# EAGLE schematic snarc+ (EAGLE 6.2)
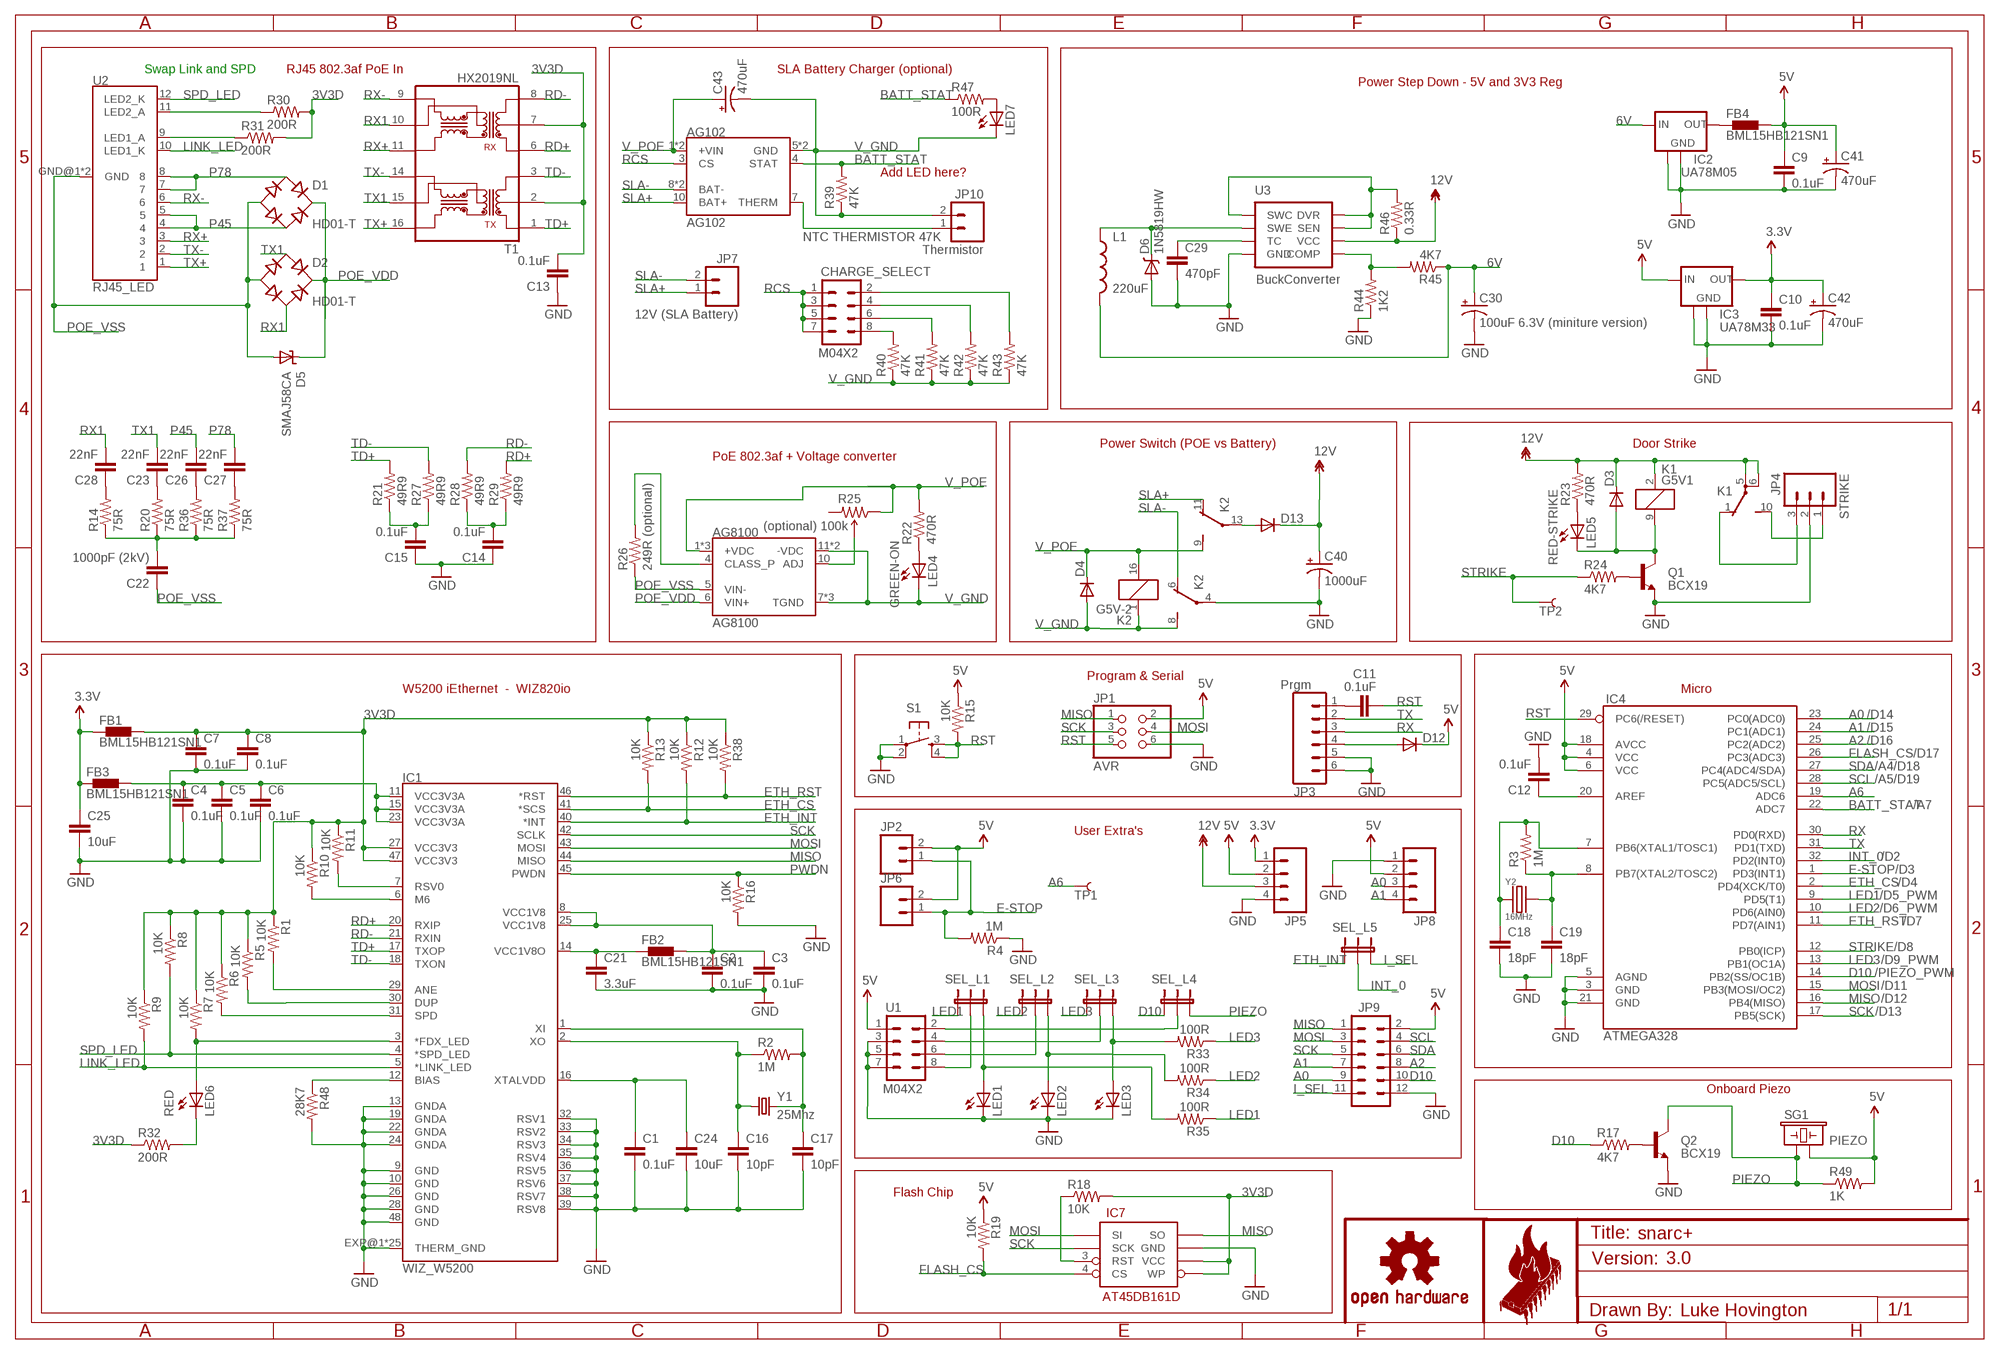
[diagram p0: schematic, sheet 1]

## Parts
AG102  AG102  [AG102]
AG8100  AG8100  [AG8100]
C1  0.1uF  CAP0402-CAP  [0402-CAP]
C2  0.1uF  CAP0402-CAP  [0402-CAP]
C3  0.1uF  CAP0402-CAP  [0402-CAP]
C4  0.1uF  CAP0402-CAP  [0402-CAP]
C5  0.1uF  CAP0402-CAP  [0402-CAP]
C6  0.1uF  CAP0402-CAP  [0402-CAP]
C7  0.1uF  CAP0402-CAP  [0402-CAP]
C8  0.1uF  CAP0402-CAP  [0402-CAP]
C9  0.1uF  CAP0402-CAP  [0402-CAP]
C10  0.1uF  CAP0402-CAP  [0402-CAP]
C11  0.1uF  CAP0402-CAP  [0402-CAP]
C12  0.1uF  CAP0402-CAP  [0402-CAP]
C13  0.1uF  CAP0402-CAP  [0402-CAP]
C14  0.1uF  CAP0402-CAP  [0402-CAP]
C15  0.1uF  CAP0402-CAP  [0402-CAP]
C16  10pF  CAP0402-CAP  [0402-CAP]
C17  10pF  CAP0402-CAP  [0402-CAP]
C18  18pF  CAP0402-CAP  [0402-CAP]
C19  18pF  CAP0402-CAP  [0402-CAP]
C21  3.3uF  CAP0402-CAP  [0402-CAP]
C22  1000pF (2kV)  CAP0402-CAP  [0402-CAP]
C23  22nF  CAP0402-CAP  [0402-CAP]
C24  10uF  CAP0603-CAP  [0603-CAP]
C25  10uF  CAP0603-CAP  [0603-CAP]
C26  22nF  CAP0402-CAP  [0402-CAP]
C27  22nF  CAP0402-CAP  [0402-CAP]
C28  22nF  CAP0402-CAP  [0402-CAP]
C29  470pF  CAP0402-CAP  [0402-CAP]
C30  100uF 6.3V (miniture version)  CAP_POLC  [PANASONIC_C]
C40  1000uF  CAP_POLH13  [PANASONIC_H13]
C41  470uF  CAP_POLE  [PANASONIC_E]
C42  470uF  CAP_POLE  [PANASONIC_E]
C43  470uF  CAP_POLE  [PANASONIC_E]
CHARGE_SELECT  M04X2  [2X4]
D1  HD01-T  B1S  [MBS]
D2  HD01-T  B1S  [MBS]
D3  DIODESOD  [SOD-323]
D4  DIODESOD  [SOD-323]
D5  SMAJ58CA  SUPPRESSOR-SMBJ  [SMBJ]
D6  1N5819HW  DIODE-SCHOTTKYSOD-123  [SOD-123]
D12  DIODESOD  [SOD-323]
D13  DIODESOD  [SOD-323]
FB1  BML15HB121SN1  [0402]
FB2  BML15HB121SN1  [0402]
FB3  BML15HB121SN1  [0402]
FB4  BML15HB121SN1  [0402]
IC1  WIZ_W5200  [QFN48]
IC2  UA78M05  V_REG_SOTXXX  [SOT223]
IC3  UA78M33  V_REG_SOTXXX  [SOT223]
IC4  ATMEGA328  ATMEGA168  [TQFP32-08]
IC7  AT45DB161D  [SO08-EIAJ]
JP1  AVR  PINHD-2X3  [2X03]
JP2  M023.5MM  [SCREWTERMINAL-3.5MM-2]
JP3  Prgm  M06SMD-STRAIGHT  [1X06_SMD_STRAIGHT]
JP4  STRIKE  M03SCREW  [SCREWTERMINAL-3.5MM-3]
JP5  M04SMD  [1X04-SMD]
JP6  M021X02_NO_SILK  [1X02_NO_SILK]
JP7  12V (SLA Battery)  M023.5MM  [SCREWTERMINAL-3.5MM-2]
JP8  M04POLAR  [MOLEX-1X4]
JP9  M05x2_SMD  M06X2  [2X6-SHROUDED_SMD]
JP10  Thermistor  M023.5MM  [SCREWTERMINAL-3.5MM-2]
K1  G5V1  [G5V1]
K2  G5V-2  [G5V-2]
L1  220uF  INDUCTOR  [SRN]
LED1  LED0603  [LED-0603]
LED2  LED0603  [LED-0603]
LED3  LED0603  [LED-0603]
LED4  GREEN-ON  LED0603  [LED-0603]
LED5  RED-STRIKE  LED0603  [LED-0603]
LED6  RED  LED0603  [LED-0603]
LED7  LED0603  [LED-0603]
Q1  BCX19  TRANSISTOR_NPNSOT23-3  [SOT23-3]
Q2  BCX19  TRANSISTOR_NPNSOT23-3  [SOT23-3]
R1  10K  RESISTOR0402-RES  [0402-RES]
R2  1M  RESISTOR0402-RES  [0402-RES]
R3  1M  RESISTOR0402-RES  [0402-RES]
R4  1M  RESISTOR0603-RES  [0603-RES]
R5  10K  RESISTOR0402-RES  [0402-RES]
R6  10K  RESISTOR0402-RES  [0402-RES]
R7  10K  RESISTOR0402-RES  [0402-RES]
R8  10K  RESISTOR0402-RES  [0402-RES]
R9  10K  RESISTOR0402-RES  [0402-RES]
R10  10K  RESISTOR0402-RES  [0402-RES]
R11  10K  RESISTOR0402-RES  [0402-RES]
R12  10K  RESISTOR0402-RES  [0402-RES]
R13  10K  RESISTOR0402-RES  [0402-RES]
R14  75R  RESISTOR0402-RES  [0402-RES]
R15  10K  RESISTOR0402-RES  [0402-RES]
R16  10K  RESISTOR0402-RES  [0402-RES]
R17  4K7  RESISTOR0402-RES  [0402-RES]
R18  10K  RESISTOR0402-RES  [0402-RES]
R19  10K  RESISTOR0402-RES  [0402-RES]
R20  75R  RESISTOR0402-RES  [0402-RES]
R21  49R9  RESISTOR0402-RES  [0402-RES]
R22  470R  RESISTOR0402-RES  [0402-RES]
R23  470R  RESISTOR0402-RES  [0402-RES]
R24  4K7  RESISTOR0402-RES  [0402-RES]
R25  (optional) 100k  TRIMPOTSMD  [TRIMPOT-3MM]
R26  249R (optional)  RESISTOR1206  [1206]
R27  49R9  RESISTOR0402-RES  [0402-RES]
R28  49R9  RESISTOR0402-RES  [0402-RES]
R29  49R9  RESISTOR0402-RES  [0402-RES]
R30  200R  RESISTOR0402-RES  [0402-RES]
R31  200R  RESISTOR0402-RES  [0402-RES]
R32  200R  RESISTOR0402-RES  [0402-RES]
R33  100R  RESISTOR0402-RES  [0402-RES]
R34  100R  RESISTOR0402-RES  [0402-RES]
R35  100R  RESISTOR0402-RES  [0402-RES]
R36  75R  RESISTOR0402-RES  [0402-RES]
R37  75R  RESISTOR0402-RES  [0402-RES]
R38  10K  RESISTOR0402-RES  [0402-RES]
R39  47K  RESISTOR0402-RES  [0402-RES]
R40  47K  RESISTOR0402-RES  [0402-RES]
R41  47K  RESISTOR0402-RES  [0402-RES]
R42  47K  RESISTOR0402-RES  [0402-RES]
R43  47K  RESISTOR0402-RES  [0402-RES]
R44  1K2  RESISTOR0402-RES  [0402-RES]
R45  4K7  RESISTOR0402-RES  [0402-RES]
R46  0.33R  RESISTOR0402-RES  [0402-RES]
R47  100R  RESISTOR0402-RES  [0402-RES]
R48  28K7  RESISTOR0402-RES  [0402-RES]
R49  1K  RESISTOR0402-RES  [0402-RES]
S1  TAC_SWITCHSMD  [TACTILE_SWITCH_SMD]
SEL_L1  JUMPER-32-3  [SJ_3_PASTE2&3]
SEL_L2  JUMPER-32-3  [SJ_3_PASTE2&3]
SEL_L3  JUMPER-32-3  [SJ_3_PASTE2&3]
SEL_L4  JUMPER-32-3  [SJ_3_PASTE2&3]
SEL_L5  JUMPER-32-3  [SJ_3_PASTE2&3]
SG1  PIEZO  BUZZER  [PB158-BUZZER]
T1  HX2019NL  HX1188  [HXXXX]
TP1  TEST-POINT3X5  [PAD.03X.05]
TP2  TEST-POINT3X5  [PAD.03X.05]
U1  M04X2  [2X4]
U2  RJ45_LED  [RJHSE-5484]
U3  BuckConverter  MC34063SMD  [SO08]
U$15  OSHW-LOGOL  [OSHW-LOGO-L]
U$16  HSBNE_LOGOMED  [HSBNE_MED]
Y1  25Mhz  CRYSTALABM10  [CRYSTAL-SMD-2.5X2-ABM10]
Y2  16MHz  ABM8  [XTAL-CSX750]

## Nets
3.3V: C10.1 C25.1 C42.+ FB1.1 FB3.1 IC3.3(OUT) JP5.1
3V3A: C4.1 C5.1 C6.1 FB3.2 IC1.11(VCC3V3A) IC1.15(VCC3V3A) IC1.23(VCC3V3A)
3V3D: C7.1 C8.1 C13.2 FB1.2 IC1.27(VCC3V3) IC1.47(VCC3V3) IC7.5(WP) IC7.6(VCC) R1.1 R5.1 R6.1 R7.1 R8.1 R9.1 R10.1 R11.1 R12.1 R13.1 R18.2 R30.2 R31.2 R32.1 R38.1 T1.2 T1.7
5V: C9.1 C41.+ D12.1(C) FB4.2 IC3.1(IN) IC4.4(VCC) IC4.6(VCC) IC4.18(AVCC) JP1.2 JP2.2 JP5.2 JP6.2 JP8.2 JP9.2 R15.1 R19.1 R49.2 SG1.P$2 U1.1
6V: C30.+ IC2.1(IN) L1.P$2 R45.1
12V: C40.+ D3.1(C) D13.1(C) JP5.3 K1.2 K1.5(2:P) K1.6(2:P) R23.2 R46.1 U3.6(VCC)
A0: IC4.23(PC0(ADC0)) JP8.3 JP9.9
A1: IC4.24(PC1(ADC1)) JP8.4 JP9.7
A2: IC4.25(PC2(ADC2)) JP9.8
A6: IC4.19(ADC6) TP1.P$1
AREF1: C12.1 IC4.20(AREF)
BATT_STAT: AG102.4(STAT) IC4.22(ADC7) R39.2 R47.1
BATT_THERM: AG102.7(THERM) JP10.1
D10: IC4.14(PB2(SS/OC1B)) JP9.10 R17.1 SEL_L4.1
E-STOP: IC4.1(PD3(INT1)) JP2.1 JP6.1 R4.2
ETH_CS: IC1.41(*SCS) IC4.2(PD4(XCK/T0)) R13.2
ETH_INT: IC1.40(*INT) R12.2 SEL_L5.1
ETH_RST: IC1.46(*RST) IC4.11(PD7(AIN1)) R38.2
FDX_LED: IC1.3(*FDX_LED) LED6.A R7.2
FLASH_CS: IC4.26(PC3(ADC3)) IC7.4(CS) R19.2
GND: C1.2 C2.2 C3.2 C4.2 C5.2 C6.2 C7.2 C8.2 C9.2 C10.2 C12.2 C13.1 C14.1 C15.1 C16.2 C17.2 C18.2 C19.2 C21.2 C24.2 C25.2 C29.2 C30.- C40.- C41.- C42.- D6.2(A) IC1.9(GND) IC1.10(GND) IC1.13(GNDA) IC1.19(GNDA) IC1.22(GNDA) IC1.24(GNDA) IC1.26(GND) IC1.28(GND) IC1.32(RSV1) IC1.33(RSV2) IC1.34(RSV3) IC1.35(RSV4) IC1.36(RSV5) IC1.37(RSV6) IC1.38(RSV7) IC1.39(RSV8) IC1.48(GND) IC1.EXP@1(THERM_GND) IC1.EXP@2(THERM_GND) IC1.EXP@3(THERM_GND) IC1.EXP@4(THERM_GND) IC1.EXP@5(THERM_GND) IC1.EXP@6(THERM_GND) IC1.EXP@7(THERM_GND) IC1.EXP@8(THERM_GND) IC1.EXP@9(THERM_GND) IC1.EXP@10(THERM_GND) IC1.EXP@11(THERM_GND) IC1.EXP@12(THERM_GND) IC1.EXP@13(THERM_GND) IC1.EXP@14(THERM_GND) IC1.EXP@15(THERM_GND) IC1.EXP@16(THERM_GND) IC1.EXP@17(THERM_GND) IC1.EXP@18(THERM_GND) IC1.EXP@19(THERM_GND) IC1.EXP@20(THERM_GND) IC1.EXP@21(THERM_GND) IC1.EXP@22(THERM_GND) IC1.EXP@23(THERM_GND) IC1.EXP@24(THERM_GND) IC1.EXP@25(THERM_GND) IC2.2(GND) IC2.4(GND1) IC3.2(GND) IC3.4(GND1) IC4.3(GND) IC4.5(AGND) IC4.21(GND) IC7.7(GND) JP1.6 JP3.5 JP3.6 JP4.2 JP5.4 JP8.1 JP9.12 K2.4(1:P) LED1.C LED2.C LED3.C Q1.2(E) Q2.2(E) R4.1 R16.2 R44.1 R48.2 S1.1 S1.2 U1.3 U1.5 U1.7 U3.4(GND)
I_SEL: JP9.11 SEL_L5.3
INT_0: IC4.32(PD2(INT0)) SEL_L5.2
LED1: IC4.9(PD5(T1)) R35.1 SEL_L1.1
LED2: IC4.10(PD6(AIN0)) R34.1 SEL_L2.1
LED3: IC4.13(PB1(OC1A)) R33.1 SEL_L3.1
LINK_LED: IC1.5(*LINK_LED) R9.2 U2.10(LED1_K)
MISO: IC1.44(MISO) IC4.16(PB4(MISO)) IC7.8(SO) JP1.1 JP9.1
MOSI: IC1.43(MOSI) IC4.15(PB3(MOSI/OC2)) IC7.1(SI) JP1.4 JP9.3
N$1: IC1.12(BIAS) R48.1
N$2: C1.1 C24.1 IC1.16(XTALVDD)
N$3: IC1.6(M6) R10.2
N$4: C2.1 C3.1 FB2.2 IC1.8(VCC1V8) IC1.25(VCC1V8)
N$5: C16.1 IC1.2(XO) R2.1 Y1.P$1
N$6: C17.1 IC1.1(XI) R2.2 Y1.P$3
N$7: IC1.29(ANE) R1.2
N$8: IC1.30(DUP) R5.2
N$9: C21.1 FB2.1 IC1.14(VCC1V8O)
N$10: IC1.31(SPD) R6.2
N$11: SEL_L3.2 U1.4
N$12: IC1.7(RSV0) R11.2
N$13: LED6.C R32.2
N$14: LED7.A R47.2
N$15: C28.1 R14.2
N$16: LED1.A R35.2 SEL_L1.3
N$17: AG8100.4(CLASS_P) R26.2
N$18: Q2.1(B) R17.2
N$20: C23.1 R20.2
N$21: C22.2 R14.1 R20.1 R36.1 R37.1
N$22: IC7.3(RST) R18.1
N$23: AG8100.10(ADJ) R25.2(WIPER)
N$24: FB4.1 IC2.3(OUT)
N$25: R30.1 U2.11(LED2_A)
N$26: D13.2(A) K2.13(2:P)
N$27: R31.1 U2.9(LED1_A)
N$28: C15.2 R21.1 R27.1
N$29: C18.1 IC4.7(PB6(XTAL1/TOSC1)) R3.2 Y2.1
N$30: C19.1 IC4.8(PB7(XTAL2/TOSC2)) R3.1 Y2.3
N$31: C14.2 R28.1 R29.1
N$32: C26.1 R36.2
N$33: CHARGE_SELECT.8 R40.2
N$34: CHARGE_SELECT.6 R41.2
N$35: CHARGE_SELECT.4 R42.2
N$36: CHARGE_SELECT.2 R43.2
N$37: R44.2 R45.2 U3.5(COMP)
N$38: C27.1 R37.2
N$39: SEL_L1.2 U1.8
N$40: C11.2 JP3.1
N$41: R46.2 U3.1(SWC) U3.7(SEN) U3.8(DVR)
N$42: LED2.A R34.2 SEL_L2.3
N$43: D6.1(C) L1.P$1 U3.2(SWE)
N$44: C29.1 U3.3(TC)
N$45: LED3.A R33.2 SEL_L3.3
N$65: D12.2(A) JP3.4
N$68: D3.2(A) K1.9 LED5.C Q1.3(C)
N$69: Q1.1(B) R24.2
N$70: LED5.A R23.1
N$71: LED4.A R22.1
N$74: SEL_L2.2 U1.6
N$100: SEL_L4.2 U1.2
P45: C26.2 D1.AC2 U2.4 U2.5
P78: C27.2 D1.AC1 U2.7 U2.8
PIEZO: Q2.3(C) R49.1 SEL_L4.3 SG1.P$1
POE_VDD: AG8100.6(VIN+) D1.+ D2.+ D5.C
POE_VSS: AG8100.5(VIN-) C22.1 D1.- D2.- D5.A R26.1 U2.GND@1(GND) U2.GND@2(GND)
PWDN: IC1.45(PWDN) R16.1
RCS: AG102.3(CS) CHARGE_SELECT.1 CHARGE_SELECT.3 CHARGE_SELECT.5 CHARGE_SELECT.7
RD+: IC1.20(RXIP) R29.2 T1.6
RD-: IC1.21(RXIN) R28.2 T1.8
RST: C11.1 IC4.29(PC6(/RESET)) JP1.5 R15.2 S1.3 S1.4
RX: IC4.30(PD0(RXD)) JP3.3
RX1: C28.2 D2.AC2 T1.10
RX+: T1.11 U2.3
RX-: T1.9 U2.6
SCK: IC1.42(SCLK) IC4.17(PB5(SCK)) IC7.2(SCK) JP1.3 JP9.5
SCL: IC4.28(PC5(ADC5/SCL)) JP9.4
SDA: IC4.27(PC4(ADC4/SDA)) JP9.6
SLA+: AG102.10(BAT+) JP7.1 K2.11(2:O)
SLA-: AG102.8(BAT-) AG102.9(BAT-) JP7.2 K2.6(1:O)
SPD_LED: IC1.4(*SPD_LED) R8.2 U2.12(LED2_K)
STRIKE: IC4.12(PB0(ICP)) R24.1 TP2.P$1
STRIKE_NC: JP4.3 K1.1(2:O)
STRIKE_NO: JP4.1 K1.10(2:S)
TD+: IC1.17(TXOP) R21.2 T1.1
TD-: IC1.18(TXON) R27.2 T1.3
TX: IC4.31(PD1(TXD)) JP3.2
TX1: C23.2 D2.AC1 T1.15
TX+: T1.16 U2.1
TX-: T1.14 U2.2
V_GND: AG102.5(GND) AG102.6(GND) AG8100.7(TGND) AG8100.8(TGND) AG8100.9(TGND) AG8100.11(-VDC) AG8100.12(-VDC) C43.- D4.2(A) JP10.2 K2.1 K2.8(1:S) LED4.C LED7.C R39.1 R40.1 R41.1 R42.1 R43.1
V_POE: AG102.1(+VIN) AG102.2(+VIN) AG8100.1(+VDC) AG8100.2(+VDC) AG8100.3(+VDC) C43.+ D4.1(C) K2.9(2:S) K2.16 R22.2 R25.1(CCW)
Unconnected: R25.3(CW)

## Notes on the sheet
- Swap Link and SPD | RJ45 802.3af PoE In | SLA Battery Charger (optional)
- Power Step Down - 5V and 3V3 Reg
- Add LED here?
- NTC THERMISTOR 47K
- Power Switch (POE vs Battery) | Door Strike
- PoE 802.3af + Voltage converter
- Program & Serial
- W5200 iEthernet  -  WIZ820io | Micro
- /D14
- /D15
- /D16
- /D17
- /A4/D18
- /A5/D19
- /A7
- User Extra's
- /D2
- /D3
- /D4
- /D5_PWM
- /D6_PWM
- /D7
- /D8
- /D9_PWM
- /PIEZO_PWM
- /D11
- /D12
- /D13
- Onboard Piezo
- Flash Chip
- 3.0
- Luke Hovington

## Library data of the parts
AG102 = pulse-luke:AG102
AG8100 = pulse-luke:AG8100
C1-C19 C21-C29 = SparkFun:CAP: Capacitor Standard 0603 ceramic capacitor, and 0.1" leaded capacitor.
C30 C40-C43 = SparkFun:CAP_POL: Capacitor Polarized These are standard SMD and PTH capacitors. Normally 10uF, 47uF, and 100uF in electrolytic and tantalum varieties. Always verify the external diameter of the through hole cap, it varies with capacity, voltage, and manufacturer. The EIA devices should be standard.
CHARGE_SELECT U1 = SparkFun:M04X2
D1 D2 = rectifier:B*S: Surface Mount Glass Passivated Bridge Rectifiers Source: Comchip Bridge Rectifiers B05S-G_B10S-G.pdf
D3 D4 D12 D13 = SparkFun:DIODE: Diode These are standard reverse protection diodes and small signal diodes. SMA package can handle up to about 1A. SOD-323 can handle about 200mA. What the SOD-323 package when ordering, there are some mfgs out there that are 5-pin packages.
D5 = diode:SUPPRESSOR-: Suppressor diode
D6 = SparkFun:DIODE-SCHOTTKY
FB1-FB4 = inductors:BML15H: EMIFIL (R) Chip Ferrite Bead for GHz Noise Source: http://www.murata.com/ Ferrite Bead BLM15H.pdf
IC1 = pulse-luke:WIZ_W5200
IC2 IC3 = rfbee:V_REG_SOTXXX
IC4 = SparkFun:ATMEGA168
IC7 = SparkFun-DigitalIC:AT45DB161D: 16-Mbit SPI flash memory
JP1 = pinhead:PINHD-2X3: PIN HEADER
JP2 JP6 JP7 JP10 = SparkFun:M02: Header 2 Standard 2-pin 0.1" header. Use with straight break away headers (SKU : PRT-00116), right angle break away headers (PRT-00553), swiss pins (PRT-00743), machine pins (PRT-00117), and female headers (PRT-00115). Molex polarized connector foot print use with SKU : PRT-08233 with associated crimp pins and housings.
JP3 = SparkFun:M06: Header 6 Standard 6-pin 0.1" header. Use with straight break away headers (SKU : PRT-00116), right angle break away headers (PRT-00553), swiss pins (PRT-00743), machine pins (PRT-00117), and female headers (PRT-00115). Molex polarized connector foot print use with SKU : PRT-08094 with associated crimp pins and housings. NOTES ON THE VARIANTS LOCK and LOCK_LONGPADS... This footprint was designed to help hold the alignment of a through-hole component (i.e. 6-pin header) while soldering it into place. You may notice that each hole has been shifted either up or down by 0.005 of an inch from it's more standard position (which is a perfectly straight line). This slight alteration caused the pins (the squares in the middle) to touch the edges of the holes. Because they are alternating, it causes a "brace" to hold the component in place. 0.005 has proven to be the perfect amount of "off-center" position when using our standard breakaway headers. Although looks a little odd when you look at the bare footprint, once you have a header in there, the alteration is very hard to notice. Also, if you push a header all the way into place, it is covered up entirely on the bottom side. This idea of altering the position of holes to aid alignment will be further integrated into the Sparkfun Library for other footprints. It can help hold any component with 3 or more connection pins.
JP4 = SparkFun-Connectors:M03: Header 3 Standard 3-pin 0.1" header. Use with straight break away headers (SKU : PRT-00116), right angle break away headers (PRT-00553), swiss pins (PRT-00743), machine pins (PRT-00117), and female headers (PRT-00115). Molex polarized connector foot print use with SKU : PRT-08232 with associated crimp pins and housings.
JP5 JP8 = SparkFun:M04: Header 4 Standard 4-pin 0.1" header. Use with straight break away headers (SKU : PRT-00116), right angle break away headers (PRT-00553), swiss pins (PRT-00743), machine pins (PRT-00117), and female headers (PRT-00115). Molex polarized connector foot print use with SKU : PRT-08231 with associated crimp pins and housings. 1MM SMD Version SKU: PRT-10208
JP9 = SparkFun:M06X2
K1 = relay:G5V1: RELAY 1 x switch, 0.5 A/125 V AC, 1 A/24 V DC , Omron; MPN: G5V-1-DC24; OC_FARNELL: 9949593; OC_NEWARK: 36M6377
K2 = relay:G5V-2: OMRON PCB Relay Source: http://www.omron.com/ecb/products/pdf/en-g5v2.pdf; MPN: G5V-2 5DC; OC_FARNELL: 9949488; OC_NEWARK: 78K5703
L1 = SparkFun:INDUCTOR: Inductors Basic Inductor/Choke - 0603 and 1206. Footprints are not proven and vary greatly between part numbers.
LED1-LED7 = freetronics:LED: LEDs Standard schematic elements and footprints for 5mm, 3mm, 1206, and 0603 sized LEDs. 5mm - Spark Fun Electronics SKU : COM-00529 (and others)
Q1 Q2 = freetronics-original:TRANSISTOR_NPN: Transistor NPN BJT configuration in SOT23 package. MMBT2222 is the common NPN we use. Double check BCE configuration again layout.
R1-R24 R26-R49 = SparkFun:RESISTOR: Resistor Basic schematic elements and footprints for 0603, 1206, and PTH resistors.
R25 = SparkFun:TRIMPOT
S1 = SparkFun:TAC_SWITCH: Momentary Switch Button commonly used for reset or general input. Spark Fun Electronics SKU : COM-00097
SEL_L1-SEL_L5 = SparkFun:JUMPER-3
SG1 = SparkFun:BUZZER: Buzzer 12mm Spark Fun Electronics SKU : Comp-Buzzer
T1 = pulse-eng:HX1188: Transformer- H110X, H1121, HX1188
TP1 TP2 = SparkFun-Passives:TEST-POINT: Bare copper test points for troubleshooting or ICT
U2 = pulse-luke:RJ45_LED
U3 = SparkFun:MC34063
U$15 = SparkFun:OSHW-LOGO: Open Source Hardware Logo This logo indicates the piece of hardware it is found on incorporates a OSHW license and/or adheres to the definition of open source hardware found here: http://freedomdefined.org/OSHW
U$16 = HSBNE:HSBNE_LOGO
Y1 = cry:CRYSTAL: Crystals Various standard crystals. Proven footprints. Spark Fun Electronics SKU : COM-00534
Y2 = jt-crystals:ABM8

## Net classes
2 gnd: width 0.305 mm, drill 0.406 mm, clearance 0.203 mm
3 power usb: width 0.508 mm, drill 0.406 mm, clearance 0.203 mm